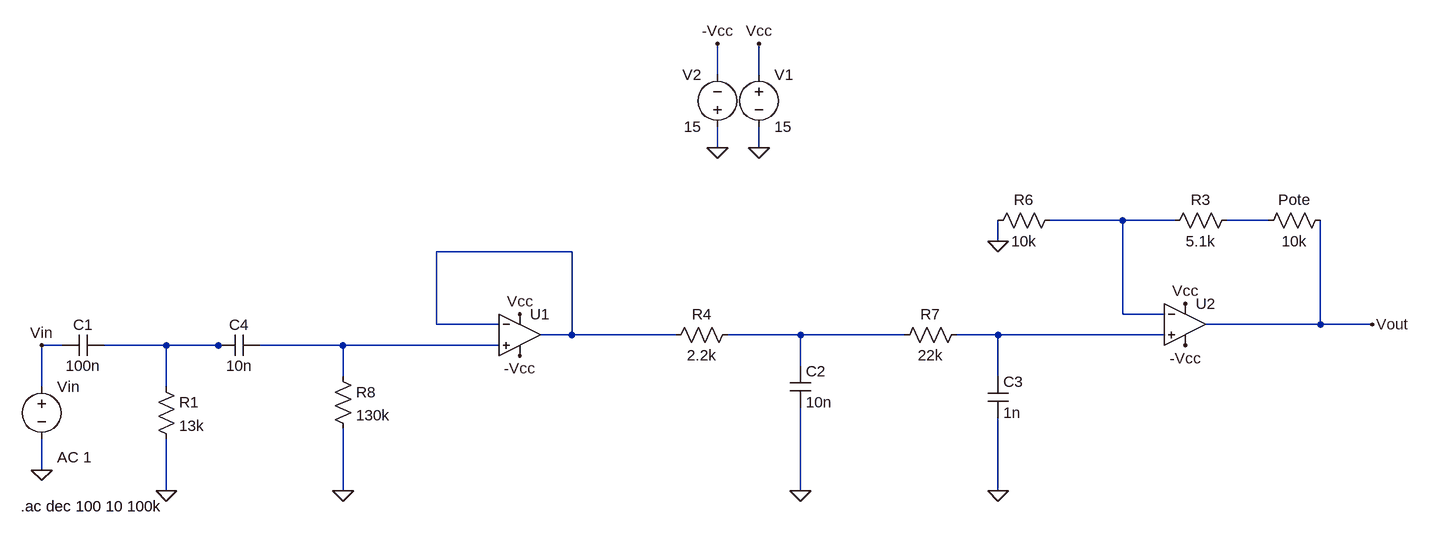
[diagram p0: schematic Filtro_pasa_bandas_200Hz_4K_Hz.asc]
Filtro_pasa_bandas_200Hz_4K_Hz.asc, the LTspice schematic file:
Version 4.1
SHEET 1 1784 680
WIRE 704 -304 704 -352
WIRE 768 -304 768 -352
WIRE 704 -192 704 -224
WIRE 768 -192 768 -224
WIRE 1328 -80 1216 -80
WIRE 1408 -80 1328 -80
WIRE 1552 -80 1488 -80
WIRE 1136 -48 1136 -80
WIRE 480 -32 272 -32
WIRE 1328 64 1328 -80
WIRE 1392 64 1328 64
WIRE 272 80 272 -32
WIRE 368 80 272 80
WIRE 1632 80 1632 -80
WIRE 1632 80 1456 80
WIRE 1712 80 1632 80
WIRE 480 96 480 -32
WIRE 480 96 432 96
WIRE 640 96 480 96
WIRE 832 96 720 96
WIRE 992 96 832 96
WIRE 1136 96 1072 96
WIRE 1392 96 1136 96
WIRE -304 112 -336 112
WIRE -144 112 -240 112
WIRE -64 112 -144 112
WIRE -48 112 -64 112
WIRE 128 112 0 112
WIRE 368 112 128 112
WIRE 832 144 832 96
WIRE 128 160 128 112
WIRE 1136 160 1136 96
WIRE -336 176 -336 112
WIRE -144 176 -144 112
WIRE -336 304 -336 256
WIRE -144 336 -144 256
WIRE 128 336 128 240
WIRE 832 336 832 208
WIRE 1136 336 1136 224
FLAG -144 336 0
FLAG 832 336 0
FLAG 1136 -48 0
FLAG 704 -192 0
FLAG 768 -192 0
FLAG 768 -352 Vcc
FLAG 704 -352 -Vcc
FLAG 400 64 Vcc
FLAG 1424 48 Vcc
FLAG 400 128 -Vcc
FLAG 1424 112 -Vcc
FLAG -336 304 0
FLAG 1712 80 Vout
FLAG -336 112 Vin
FLAG 1136 336 0
FLAG 128 336 0
SYMBOL cap -240 96 R90
WINDOW 0 0 32 VBottom 2
WINDOW 3 32 32 VTop 2
SYMATTR InstName C1
SYMATTR Value 100n
SYMBOL res -160 160 R0
SYMATTR InstName R1
SYMATTR Value 13k
SYMBOL OpAmps\\UniversalOpAmp 400 96 R0
SYMATTR InstName U1
SYMBOL res 736 80 R90
WINDOW 0 0 56 VBottom 2
WINDOW 3 32 56 VTop 2
SYMATTR InstName R4
SYMATTR Value 2.2k
SYMBOL cap 816 144 R0
SYMATTR InstName C2
SYMATTR Value 10n
SYMBOL OpAmps\\UniversalOpAmp 1424 80 R0
SYMATTR InstName U2
SYMBOL res 1232 -96 R90
WINDOW 0 0 56 VBottom 2
WINDOW 3 32 56 VTop 2
SYMATTR InstName R6
SYMATTR Value 10k
SYMBOL voltage 768 -320 R0
SYMATTR InstName V1
SYMATTR Value 15
SYMBOL voltage 704 -208 R180
WINDOW 0 24 96 Left 2
WINDOW 3 24 16 Left 2
SYMATTR InstName V2
SYMATTR Value 15
SYMBOL voltage -336 160 R0
WINDOW 123 24 124 Left 2
WINDOW 39 0 0 Left 0
SYMATTR Value2 AC 1
SYMATTR InstName Vin
SYMATTR Value ""
SYMBOL res 1088 80 R90
WINDOW 0 0 56 VBottom 2
WINDOW 3 32 56 VTop 2
SYMATTR InstName R7
SYMATTR Value 22k
SYMBOL cap 1120 160 R0
SYMATTR InstName C3
SYMATTR Value 1n
SYMBOL cap 0 96 R90
WINDOW 0 0 32 VBottom 2
WINDOW 3 32 32 VTop 2
SYMATTR InstName C4
SYMATTR Value 10n
SYMBOL res 112 144 R0
SYMATTR InstName R8
SYMATTR Value 130k
SYMBOL res 1648 -96 R90
WINDOW 0 0 56 VBottom 2
WINDOW 3 32 56 VTop 2
SYMATTR InstName Pote
SYMATTR Value 10k
SYMBOL res 1504 -96 R90
WINDOW 0 0 56 VBottom 2
WINDOW 3 32 56 VTop 2
SYMATTR InstName R3
SYMATTR Value 5.1k
TEXT -368 360 Left 2 !.ac dec 100 10 100k

The netlist it stands for:
* Filtro_pasa_bandas_200Hz_4K_Hz.asc
C1 N006 Vin 100n
R1 N006 0 13k
X§U1 N007 N003 Vcc -Vcc N003 level1 Avol=1Meg GBW=10Meg Vos=0 En=0 Enk=0 In=0 Ink=0 Rin=500Meg  ; pins In+ In- V+ V- OUT
R4 N004 N003 2.2k
C2 N004 0 10n
X§U2 N005 N001 Vcc -Vcc Vout level1 Avol=1Meg GBW=10Meg Vos=0 En=0 Enk=0 In=0 Ink=0 Rin=500Meg  ; pins In+ In- V+ V- OUT
R6 N001 0 10k
V1 Vcc 0 15
V2 0 -Vcc 15
Vin Vin 0 AC 1
R7 N005 N004 22k
C3 N005 0 1n
C4 N007 N006 10n
R8 N007 0 130k
R§Pote Vout N002 10k
R3 N002 N001 5.1k
.ac dec 100 10 100k
.lib UniversalOpAmp1.lib
.backanno
.end